# Altium schematic sheet CHC_CHD.SchDoc
size A
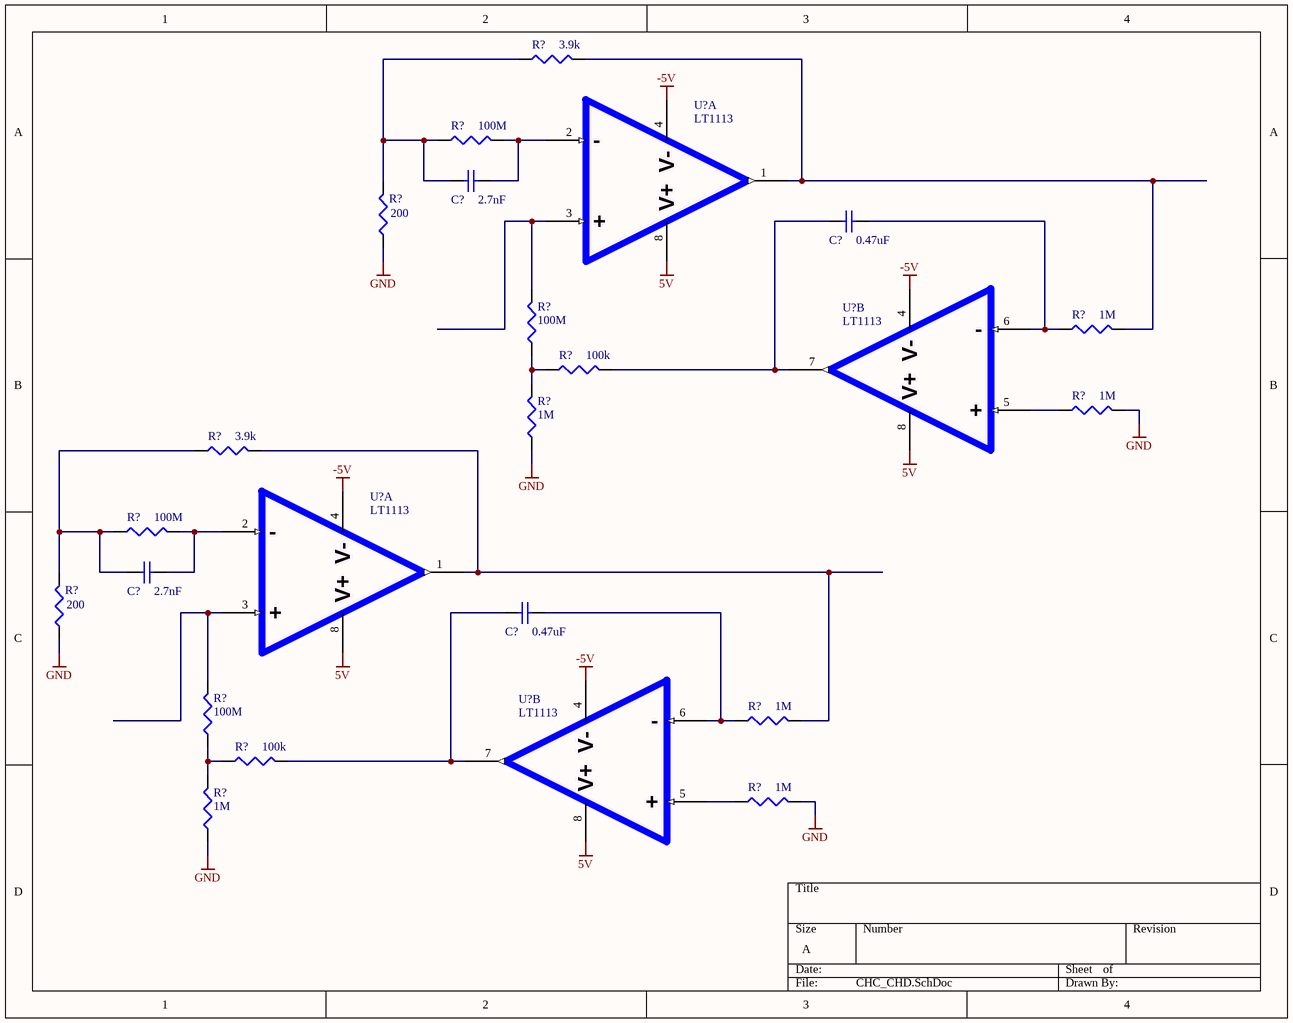
[diagram p0: CHC_CHD.SchDoc]

## Parts
(Parts that share a designator on the sheet are numbered #1, #2 ... from top to bottom, then left to right.)
C?#1  value 2.7nF  [0603]  (hidden comment: Cap Semi)
C?#2  value 0.47uF  [0603]  (hidden comment: Cap Semi)
C?#3  value 2.7nF  [0603]  (hidden comment: Cap Semi)
C?#4  value 0.47uF  [0603]  (hidden comment: Cap Semi)
R?#1  value 3.9k  [J1-0603]  (hidden comment: Res3)
R?#2  value 100M  [J1-0603]  (hidden comment: Res3)
R?#3  value 200  [J1-0603]  (hidden comment: Res3)
R?#4  value 1M  [J1-0603]  (hidden comment: Res3)
R?#5  value 100M  [J1-0603]  (hidden comment: Res3)
R?#6  value 100k  [J1-0603]  (hidden comment: Res3)
R?#7  value 1M  [J1-0603]  (hidden comment: Res3)
R?#8  value 3.9k  [J1-0603]  (hidden comment: Res3)
R?#9  value 1M  [J1-0603]  (hidden comment: Res3)
R?#10  value 100M  [J1-0603]  (hidden comment: Res3)
R?#11  value 200  [J1-0603]  (hidden comment: Res3)
R?#12  value 1M  [J1-0603]  (hidden comment: Res3)
R?#13  value 100M  [J1-0603]  (hidden comment: Res3)
R?#14  value 100k  [J1-0603]  (hidden comment: Res3)
R?#15  value 1M  [J1-0603]  (hidden comment: Res3)
R?#16  value 1M  [J1-0603]  (hidden comment: Res3)
U?#1  LT1113  [SO8_L]  (part A of 2)
U?#2  LT1113  [SO8_L]  (part B of 2)
U?#3  LT1113  [SO8_L]  (part A of 2)
U?#4  LT1113  [SO8_L]  (part B of 2)

## Nets
5V: U?#1.8(V+) U?#2.8(V+) U?#3.8(V+) U?#4.8(V+)
-5V: U?#1.4(V-) U?#2.4(V-) U?#3.4(V-) U?#4.4(V-)
GND: R?#3.1 R?#7.2 R?#9.1 R?#11.1 R?#15.2 R?#16.1
NetC?#1_1: C?#1.1 R?#1.1 R?#2.1 R?#3.2
NetC?#1_2: C?#1.2 R?#2.2 U?#1.2(-)
NetC?#2_1: C?#2.1 R?#6.2 U?#2.7(OUTA)
NetC?#2_2: C?#2.2 R?#4.1 U?#2.6(-)
NetC?#3_1: C?#3.1 R?#8.1 R?#10.1 R?#11.2
NetC?#3_2: C?#3.2 R?#10.2 U?#3.2(-)
NetC?#4_1: C?#4.1 R?#14.2 U?#4.7(OUTA)
NetC?#4_2: C?#4.2 R?#12.1 U?#4.6(-)
NetR?#1_2: R?#1.2 R?#4.2 U?#1.1(OUTA)
NetR?#5_1: R?#5.1 R?#6.1 R?#9.2
NetR?#5_2: R?#5.2 U?#1.3(+)
NetR?#7_1: R?#7.1 U?#2.5(+)
NetR?#8_2: R?#8.2 R?#12.2 U?#3.1(OUTA)
NetR?#13_1: R?#13.1 R?#14.1 R?#16.2
NetR?#13_2: R?#13.2 U?#3.3(+)
NetR?#15_1: R?#15.1 U?#4.5(+)

## Library data of the parts
C?#1-C?#4 = Cap Semi: Capacitor (Semiconductor SIM Model); Published: 8-Jun-2000; LatestRevisionDate: 29-May-2009; LatestRevisionNote: IPC-7351 Footprint Added.; PackageReference: C1206; Publisher: Altium Limited; PackageDescription: Chip Capacitor
R?#1-R?#16 = Res3: Resistor; Published: 8-Jun-2000; LatestRevisionDate: 29-May-2009; LatestRevisionNote: IPC-7351 Footprint Added.; PackageReference: J1-0603; Publisher: Altium Limited; PackageDescription: Chip Resistor
U?#1-U?#4 = LT1113: LT1113 Opamp